# EAGLE design xmas tree proto v1 (EAGLE 6.5.0)
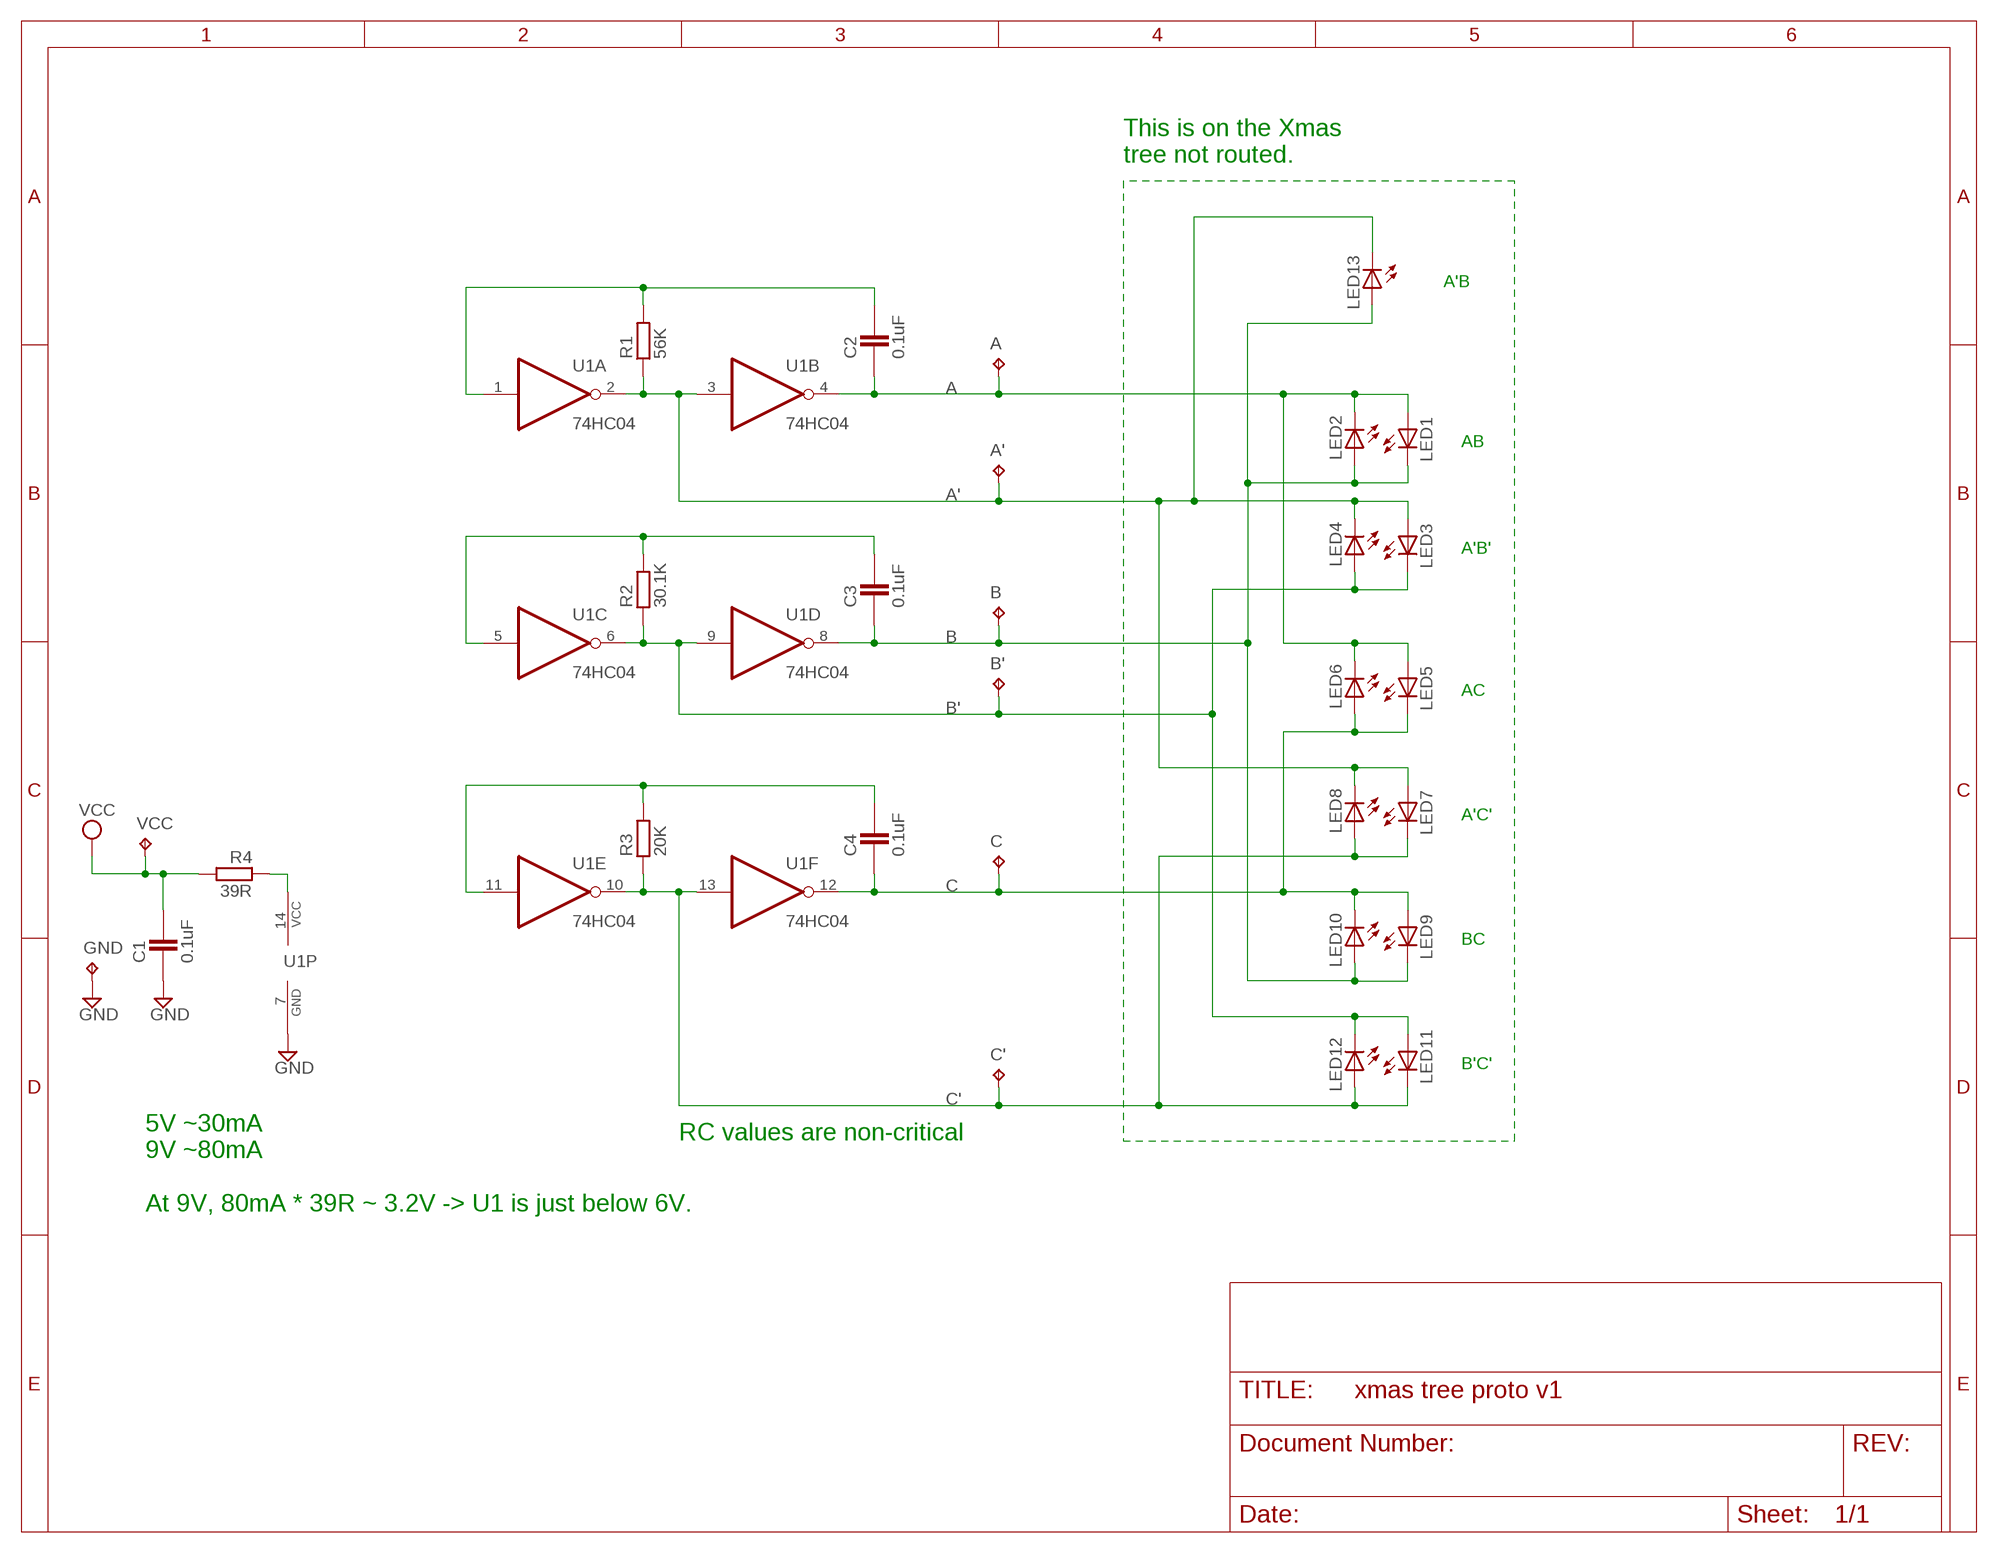
[diagram p0: schematic, sheet 1]

## Parts
A  TPTP10SQ  [TP10SQ]
A'  TPTP10SQ  [TP10SQ]
B  TPTP10SQ  [TP10SQ]
B'  TPTP10SQ  [TP10SQ]
C  TPTP10SQ  [TP10SQ]
C1  0.1uF  CAPACITOR_0805N  [CAP2012X70N]
C2  0.1uF  CAPACITOR_0603  [CAPC1608X92N]
C3  0.1uF  CAPACITOR_0603  [CAPC1608X92N]
C4  0.1uF  CAPACITOR_0603  [CAPC1608X92N]
C'  TPTP10SQ  [TP10SQ]
GND  TPTP20SQ  [TP20SQ]
LED1  LED3MM  [LED3MM]
LED2  LED3MM  [LED3MM]
LED3  LED3MM  [LED3MM]
LED4  LED3MM  [LED3MM]
LED5  LED3MM  [LED3MM]
LED6  LED3MM  [LED3MM]
LED7  LED3MM  [LED3MM]
LED8  LED3MM  [LED3MM]
LED9  LED3MM  [LED3MM]
LED10  LED3MM  [LED3MM]
LED11  LED3MM  [LED3MM]
LED12  LED3MM  [LED3MM]
LED13  LED3MM  [LED3MM]
R1  56K  RESISTOR_0603  [RESC1608X55N]
R2  30.1K  RESISTOR_0603  [RESC1608X55N]
R3  20K  RESISTOR_0603  [RESC1608X55N]
R4  39R  RESISTOR_0603  [RESC1608X55N]
U1  74HC04  74AS04D  [SO14]
VCC  TPTP20SQ  [TP20SQ]

## Nets
A: A.TP C2.1 LED1.A LED2.K(C) LED5.A LED6.K(C) U1.4(B:O)
A': A'.TP LED3.A LED4.K(C) LED7.A LED8.K(C) LED13.K(C) R1.1 U1.2(A:O) U1.3(B:I)
B: B.TP C3.1 LED1.K(C) LED2.A LED9.K(C) LED10.A LED13.A U1.8(D:O)
B': B'.TP LED3.K(C) LED4.A LED11.A LED12.K(C) R2.1 U1.6(C:O) U1.9(D:I)
C: C4.1 C.TP LED5.K(C) LED6.A LED9.A LED10.K(C) U1.12(F:O)
C': C'.TP LED7.K(C) LED8.A LED11.K(C) LED12.A R3.1 U1.10(E:O) U1.13(F:I)
GND: C1.1 GND.TP U1.7(P:GND)
N$4: C4.2 R3.2 U1.11(E:I)
N$5: C3.2 R2.2 U1.5(C:I)
N$6: C2.2 R1.2 U1.1(A:I)
N$11: R4.1 U1.14(P:VCC)
VCC: C1.2 R4.2 VCC.TP

## Notes on the sheet
- This is on the Xmas 
  tree not routed.
- A'B
- AB
- A'B'
- AC
- A'C'
- BC
- B'C'
- RC values are non-critical
- 5V ~30mA
  9V ~80mA
  
  At 9V, 80mA * 39R ~ 3.2V -> U1 is just below 6V.

## Library data of the parts
A A' B B' C C' GND VCC = testpad:TP: Test pad
C1-C4 = ipc-7351-capacitor:CAPACITOR_
LED1-LED13 = led:LED: LED OSRAM: - CHIPLED LG R971, LG N971, LY N971, LG Q971, LY Q971, LO R971, LY R971 LH N974, LH R974 LS Q976, LO Q976, LY Q976 LO Q996 - Hyper CHIPLED LW Q18S LB Q993, LB Q99A, LB R99A - SideLED LS A670, LO A670, LY A670, LG A670, LP A670 LB A673, LV A673, LT A673, LW A673 LH A674 LY A675 LS A676, LA A676, LO A676, LY A676, LW A676 LS A679, LY A679, LG A679 - Hyper Micro SIDELED® LS Y876, LA Y876, LO Y876, LY Y876 LT Y87S - SmartLED LW L88C, LW L88S LB L89C, LB L89S, LG L890 LS L89K, LO L89K, LY L89K LS L896, LA L896, LO L896, LY L896 - TOPLED LS T670, LO T670, LY T670, LG T670, LP T670 LSG T670, LSP T670, LSY T670, LOP T670, LYG T670 LG T671, LOG T671, LSG T671 LB T673, LV T673, LT T673, LW T673 LH T674 LS T676, LA T676, LO T676, LY T676, LB T676, LH T676, LSB T676, LW T676 LB T67C, LV T67C, LT T67C, LS T67K, LO T67K, LY T67K, LW E67C LS E67B, LA E67B, LO E67B, LY E67B, LB E67C, LV E67C, LT E67C LW T67C LS T679, LY T679, LG T679 LS T770, LO T770, LY T770, LG T770, LP T770 LB T773, LV T773, LT T773, LW T773 LH T774 LS E675, LA E675, LY E675, LS T675 LS T776, LA T776, LO T776, LY T776, LB T776 LHGB T686 LT T68C, LB T68C - Hyper Mini TOPLED® LB M676 - Mini TOPLED Santana® LG M470 LS M47K, LO M47K, LY M47K Source: http://www.osram.convergy.de LUXEON: - LUMILED® LXK2-PW12-R00, LXK2-PW12-S00, LXK2-PW14-U00, LXK2-PW14-V00 LXK2-PM12-R00, LXK2-PM12-S00, LXK2-PM14-U00 LXK2-PE12-Q00, LXK2-PE12-R00, LXK2-PE12-S00, LXK2-PE14-T00, LXK2-PE14-U00 LXK2-PB12-K00, LXK2-PB12-L00, LXK2-PB12-M00, LXK2-PB14-N00, LXK2-PB14-P00, LXK2-PB14-Q00 LXK2-PR12-L00, LXK2-PR12-M00, LXK2-PR14-Q00, LXK2-PR14-R00 LXK2-PD12-Q00, LXK2-PD12-R00, LXK2-PD12-S00 LXK2-PH12-R00, LXK2-PH12-S00 LXK2-PL12-P00, LXK2-PL12-Q00, LXK2-PL12-R00 Source: www.luxeon.com KINGBRIGHT: KA-3528ASYC Source: www.kingbright.com
R1-R4 = ipc-7351-resistor:RESISTOR_
U1 = 74xx-us:74*04: Hex INVERTER

## Board
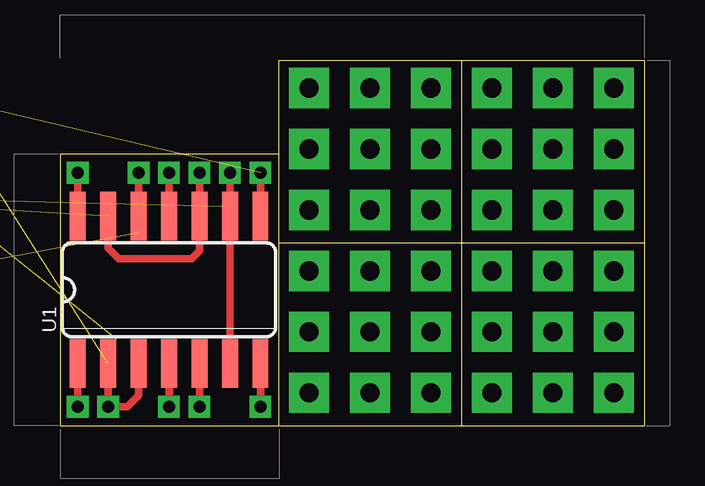
[diagram p1: board, top side]
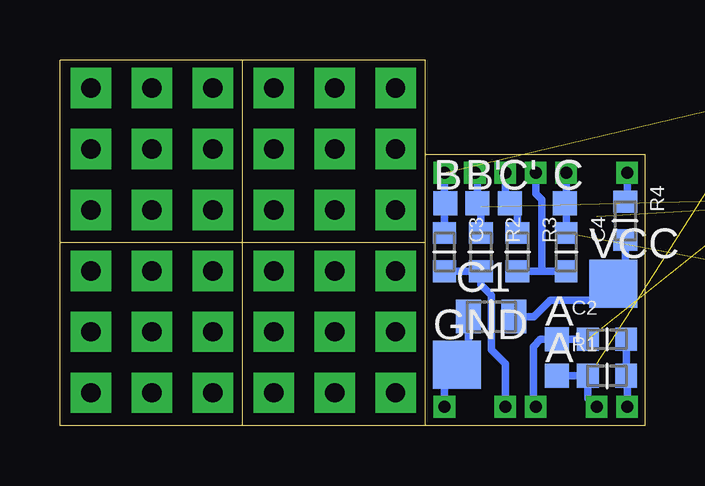
[diagram p2: board, bottom side, seen from below]

Size 24.38 x 15.24 mm. Coordinates in mm from the lower left corner, seen from the top.
Outline: 9.14,0 0,0 0,11.3 9.14,11.3
Outline: 9.14,0 9.14,7.62
Outline: 9.14,7.62 9.14,11.3
Outline: 9.14,0 16.76,0
Outline: 16.76,0 24.38,0 24.38,7.62
Outline: 24.38,7.62 24.38,15.24 16.76,15.24
Outline: 16.76,15.24 9.14,15.24 9.14,11.3
Outline: 16.76,0 16.76,7.62
Outline: 16.76,7.62 16.76,15.24
Outline: 16.76,7.62 24.38,7.62
Outline: 9.14,7.62 16.76,7.62
Copper layers (1*16): Top 0.035mm / dielectric 1.5mm / Bottom 0.035mm
Design rules "default": minimum track width 10mil, minimum drill 24mil, track to track 8mil, track to pad 8mil, pad to pad 8mil, via to via 8mil, smd to smd 8mil, copper to edge 40mil, drill to drill 8mil, minimum pad ring 10mil, minimum via ring 8mil, stop-mask expansion 4mil, vias tented up to drill 0mil, thermal gap 10mil

### Footprints (pad centres in the part's own frame; a part is rotated, then mirrored left to right if it is on the bottom)
TP10SQ = smd 1 x 1: TP 0,0
CAP2012X70N = smd 1.05 x 1.4: 1 -0.95,0; 2 0.95,0
CAPC1608X92N = smd 0.9 x 0.95: 1 -0.8,0; 2 0.8,0
TP20SQ = smd 2 x 2: TP 0,0
LED3MM = drill 0.813 octagon: A -1.27,0; K 1.27,0
RESC1608X55N = smd 0.9 x 1: 1 -0.8,0; 2 0.8,0
SO14 = smd 0.66 x 2.032: 1 -3.81,-3.073; 2 -2.54,-3.073; 3 -1.27,-3.073; 4 0,-3.073; 5 1.27,-3.073; 6 2.54,-3.073; 7 3.81,-3.073; 8 3.81,3.073; 9 2.54,3.073; 10 1.27,3.073; 11 0,3.073; 12 -1.27,3.073; 13 -2.54,3.073; 14 -3.81,3.073

### Placement (x,y rotation side)
A  3.66,3.61 0 bottom
A'  3.66,2.08 0 bottom
B  8.31,9.27 0 bottom
B'  6.99,9.27 0 bottom
C  3.33,9.27 0 bottom
C1  6.4,4.55 0 bottom
C2  1.57,3.61 0 bottom
C3  8.36,7.24 270 bottom
C4  3.28,7.24 270 bottom
C'  5.61,9.27 0 bottom
GND  7.82,2.54 0 bottom
LED1  -10.16,14.61 0 top  (outside the outline)
LED2  -20.32,14.61 0 top  (outside the outline)
LED3  -30.48,14.61 0 top  (outside the outline)
LED4  -10.16,19.68 0 top  (outside the outline)
LED5  -20.32,19.68 0 top  (outside the outline)
LED6  -30.48,19.68 0 top  (outside the outline)
LED7  -10.16,24.77 0 top  (outside the outline)
LED8  -20.32,24.77 0 top  (outside the outline)
LED9  -30.48,24.77 0 top  (outside the outline)
LED10  -20.32,3.81 0 top  (outside the outline)
LED11  -30.48,9.53 0 top  (outside the outline)
LED12  -10.16,9.53 0 top  (outside the outline)
LED13  -20.32,9.53 0 top  (outside the outline)
R1  1.57,2.08 0 bottom
R2  6.83,7.24 270 bottom
R3  5.31,7.24 270 bottom
R4  0.81,8.53 270 bottom
U1  4.55,5.66 0 top
VCC  1.32,5.92 0 bottom

### Tracks (layer width: path | path; a pad name or v marks a point on that pad's centre or on a via)
A  (via drill 0.5 pad 0.81)  (4 unrouted)
  Top 0.305: U1.4 v4.55,0.79
  Bottom 0.305: C2.1 A.TP 4.34,3.61 4.65,3.3 4.65,0.89 v4.55,0.79
A'  (via drill 0.5 pad 0.81)  (5 unrouted)
  Top 0.305: U1.2 v2.01,0.79 2.79,0.79 3.28,1.27 U1.3
  Bottom 0.305: 2.06,0.84 v2.01,0.79 2.38,1.16 R1.1 A'.TP
B  (via drill 0.5 pad 0.81)  (5 unrouted)
  Top 0.305: U1.8 v8.36,10.54
  Bottom 0.305: v8.36,10.54 8.36,9.32 B.TP 8.36,9.22 C3.1
B'  (via drill 0.5 pad 0.81)  (4 unrouted)
  Top 0.305: U1.6 U1.9 v7.09,10.54
  Bottom 0.305: v7.09,10.54 6.99,10.44 B'.TP 6.83,9.12 R2.1
C  (via drill 0.5 pad 0.81)  (4 unrouted)
  Top 0.305: U1.12 v3.28,10.54
  Bottom 0.305: C4.1 3.28,9.22 C.TP 3.28,9.32 v3.28,10.54
C'  (via drill 0.5 pad 0.81)  (4 unrouted)
  Top 0.305: U1.13 2.01,7.39 2.44,6.96 5.49,6.96 5.82,7.29 U1.10 v5.82,10.54
  Bottom 0.305: v5.82,10.54 5.82,9.42 C'.TP 5.31,8.91 R3.1
GND  (via drill 0.5 pad 0.81)
  Top 0.305: U1.7 v8.36,0.79
  Bottom 0.305: v8.36,0.79 8.36,2.01 GND.TP 7.35,3.01 C1.1
N$1  (via drill 0.8 pad 1.68)
  other vias: 10.39,1.37
N$2  (via drill 0.8 pad 1.68)
  other vias: 10.39,3.91
N$3  (via drill 0.8 pad 1.68)
  other vias: 10.39,6.45
N$4  (via drill 0.5 pad 0.81)
  Top 0.305: U1.11 v4.55,10.54
  Bottom 0.305: R3.2 4.37,6.44 | 4.37,6.44 C4.2 | v4.55,10.54 4.55,9.68 4.29,9.42 4.29,6.51 4.37,6.44
N$5  (via drill 0.5 pad 0.81)
  Top 0.305: U1.5 v5.82,0.79
  Bottom 0.305: C3.2 R2.2 6.83,5.87 6.4,5.44 6.4,3.17 U1.5 v5.82,0.79
N$6  (via drill 0.5 pad 0.81)
  Top 0.305: U1.1 v0.74,0.79
  Bottom 0.305: v0.74,0.79 0.74,2.04 R1.2 C2.2
N$7  (via drill 0.8 pad 1.68)
  other vias: 12.93,3.91
N$8  (via drill 0.8 pad 1.68)
  other vias: 12.93,6.45
N$9  (via drill 0.8 pad 1.68)
  other vias: 12.93,1.37
N$10  (via drill 0.8 pad 1.68)
  other vias: 15.47,1.37
N$11  (via drill 0.5 pad 0.81)
  Top 0.305: U1.14 v0.74,10.54
  Bottom 0.305: v0.74,10.54 0.74,9.41 R4.1
N$12  (via drill 0.8 pad 1.68)
  other vias: 15.47,3.91
N$13  (via drill 0.8 pad 1.68)
  other vias: 15.47,6.45
N$14  (via drill 0.8 pad 1.68)
  other vias: 10.39,8.99
N$15  (via drill 0.8 pad 1.68)
  other vias: 12.93,8.99
N$16  (via drill 0.8 pad 1.68)
  other vias: 15.47,8.99
N$17  (via drill 0.8 pad 1.68)
  other vias: 10.39,11.53
N$18  (via drill 0.8 pad 1.68)
  other vias: 12.93,11.53
N$19  (via drill 0.8 pad 1.68)
  other vias: 15.47,11.53
N$20  (via drill 0.8 pad 1.68)
  other vias: 10.39,14.07
N$21  (via drill 0.8 pad 1.68)
  other vias: 12.93,14.07
N$22  (via drill 0.8 pad 1.68)
  other vias: 15.47,14.07
N$23  (via drill 0.8 pad 1.68)
  other vias: 18.01,1.37
N$24  (via drill 0.8 pad 1.68)
  other vias: 18.01,3.91
N$25  (via drill 0.8 pad 1.68)
  other vias: 18.01,6.45
N$26  (via drill 0.8 pad 1.68)
  other vias: 18.01,8.99
N$27  (via drill 0.8 pad 1.68)
  other vias: 18.01,11.53
N$28  (via drill 0.8 pad 1.68)
  other vias: 18.01,14.07
N$29  (via drill 0.8 pad 1.68)
  other vias: 20.55,14.07
N$30  (via drill 0.8 pad 1.68)
  other vias: 20.55,11.53
N$31  (via drill 0.8 pad 1.68)
  other vias: 20.55,8.99
N$32  (via drill 0.8 pad 1.68)
  other vias: 20.55,6.45
N$33  (via drill 0.8 pad 1.68)
  other vias: 20.55,3.91
N$34  (via drill 0.8 pad 1.68)
  other vias: 20.55,1.37
N$35  (via drill 0.8 pad 1.68)
  other vias: 23.09,1.37
N$36  (via drill 0.8 pad 1.68)
  other vias: 23.09,3.91
N$37  (via drill 0.8 pad 1.68)
  other vias: 23.09,6.45
N$38  (via drill 0.8 pad 1.68)
  other vias: 23.09,8.99
N$39  (via drill 0.8 pad 1.68)
  other vias: 23.09,11.53
N$40  (via drill 0.8 pad 1.68)
  other vias: 23.09,14.07
VCC
  Bottom 0.305: C1.2 4.62,4.55 3.94,5.23 2.01,5.23 VCC.TP 0.81,6.43 R4.2